# Altium schematic sheet MicroMultimeter_OLED_Sch.SchDoc: MicroMultimeter - OLED
size 127 x 101 mm; Author: Hom; CompanyName: KitSprout; DrawnBy: Hom; Engineer: Hom; Organization: KitSprout; Revision: A; SheetNumber: 1; SheetTotal: 1; License: CC BY-SA 4.0; Version: 1.0; LibVersion: 1.4; PageSetup: Record=PageOptions|CenterHorizontal=True|CenterVertical=True|PrintScale=1.00|XCorrection=1.00|YCorrection=1.00|PrintKind=0|BorderSize=5000000|LeftOffset=0|BottomOffset=0|Orientation=2|PaperLength=1000|PaperWidth=1000|Scale=100|PaperSource=7|PrintQuality=-3|MediaType=1|DitherType=10|PrintScaleMode=0|PaperKind=A4|PaperIndex=9
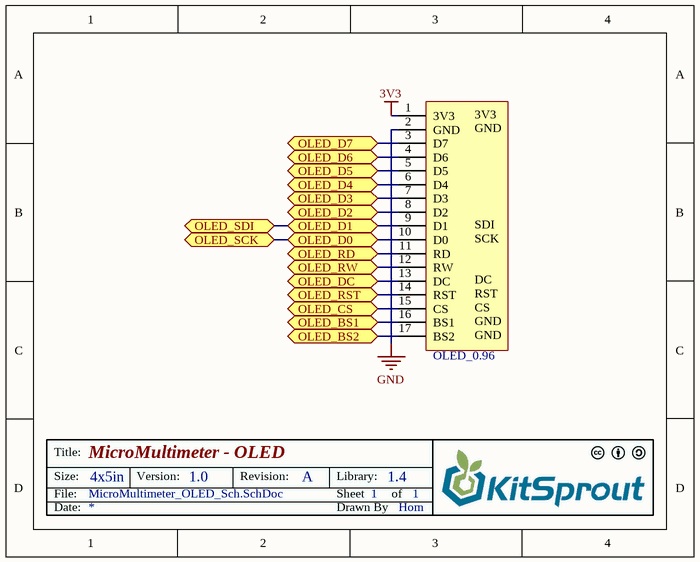
[diagram p0: MicroMultimeter_OLED_Sch.SchDoc]

## Parts
OLED_0.96  OLED_0.96  [OLED_0.96_96x64]  (value not drawn)

## Ports
OLED_BS1, OLED_BS2, OLED_CS, OLED_D0, OLED_D1, OLED_D2, OLED_D3, OLED_D4, OLED_D5, OLED_D6, OLED_D7, OLED_DC, OLED_RD, OLED_RST, OLED_RW, OLED_SCK, OLED_SDI

## Nets
3V3: OLED_0.96.1(3V3)
GND: OLED_0.96.2(GND)
OLED_BS1: OLED_0.96.16(BS1) ; port OLED_BS1
OLED_BS2: OLED_0.96.17(BS2) ; port OLED_BS2
OLED_CS: OLED_0.96.15(CS) ; port OLED_CS
OLED_D0: OLED_0.96.10(D0) ; port OLED_D0, port OLED_SCK
OLED_D1: OLED_0.96.9(D1) ; port OLED_D1, port OLED_SDI
OLED_D2: OLED_0.96.8(D2) ; port OLED_D2
OLED_D3: OLED_0.96.7(D3) ; port OLED_D3
OLED_D4: OLED_0.96.6(D4) ; port OLED_D4
OLED_D5: OLED_0.96.5(D5) ; port OLED_D5
OLED_D6: OLED_0.96.4(D6) ; port OLED_D6
OLED_D7: OLED_0.96.3(D7) ; port OLED_D7
OLED_DC: OLED_0.96.13(DC) ; port OLED_DC
OLED_RD: OLED_0.96.11(RD) ; port OLED_RD
OLED_RST: OLED_0.96.14(RST) ; port OLED_RST
OLED_RW: OLED_0.96.12(RW) ; port OLED_RW

## Notes on the sheet
- Title:
- Size:
- Date:
- File:
- 4x5in
- Version:
- Revision:
- Sheet
- Drawn By
- Library:
- of
- (in symbol OLED_0.96_96*64) SDI; SCK

## Library data of the parts
OLED_0.96 = OLED_0.96_96*64: Module